# EAGLE design try (EAGLE 9.2.2)
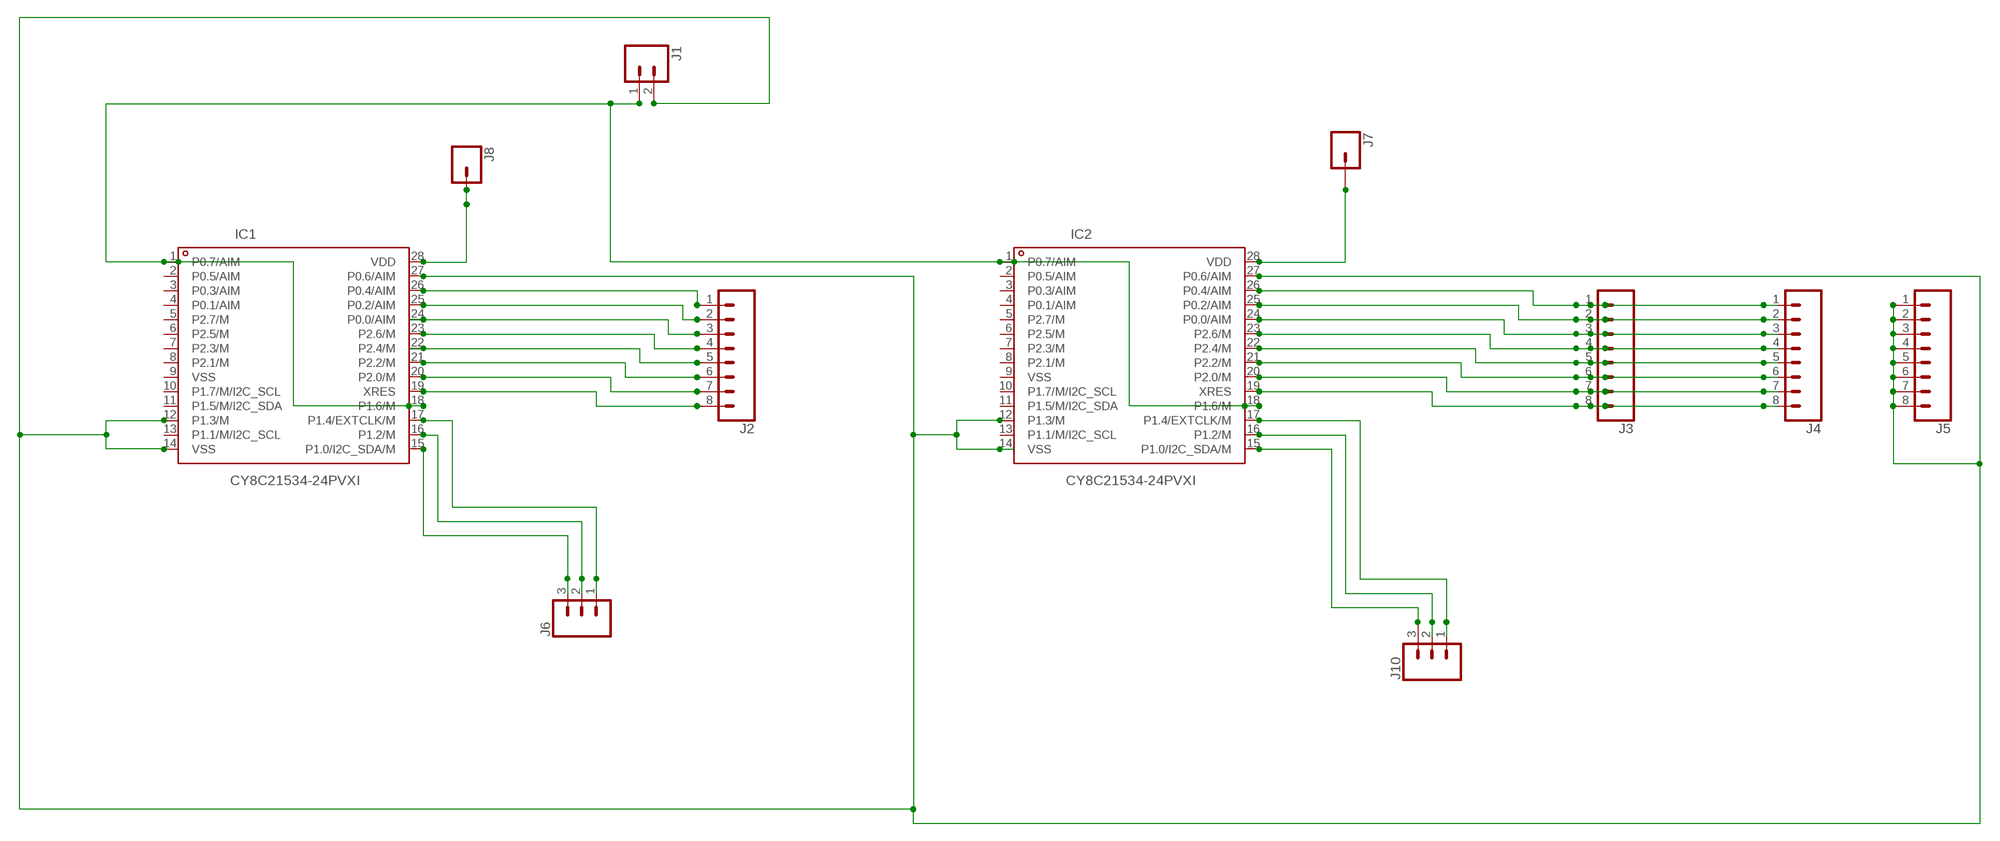
[diagram p0: schematic, sheet 1]

## Parts
IC1  CY8C21534-24PVXI  [SSOP28]
IC2  CY8C21534-24PVXI  [SSOP28]
J1  CONN_02PTH3  [1X02_LONGPADS]
J2  CONN_08LONGPADS  [1X08_LONGPADS]
J3  CONN_08LONGPADS  [1X08_LONGPADS]
J4  CONN_08LONGPADS  [1X08_LONGPADS]
J5  CONN_08LONGPADS  [1X08_LONGPADS]
J6  CONN_03LONGPADS  [1X03_LONGPADS]
J7  CONN_01PTH_LONGPAD  [1X01_LONGPAD]
J8  CONN_01PTH_LONGPAD  [1X01_LONGPAD]
J10  CONN_03LONGPADS  [1X03_LONGPADS]

## Nets
N$1: IC1.17(P1.4/EXTCLK/M) J6.1
N$2: IC2.15(P1.0/I2C_SDA/M) J10.3
N$3: IC1.12(P1.3/M) IC1.14(VSS) IC1.27(P0.6/AIM) IC2.12(P1.3/M) IC2.14(VSS) IC2.27(P0.6/AIM) J1.2 J5.1 J5.2 J5.3 J5.4 J5.5 J5.6 J5.7 J5.8
N$4: IC1.26(P0.4/AIM) J2.1
N$5: IC1.25(P0.2/AIM) J2.2
N$6: IC1.24(P0.0/AIM) J2.3
N$7: IC1.23(P2.6/M) J2.4
N$8: IC1.22(P2.4/M) J2.5
N$9: IC1.21(P2.2/M) J2.6
N$10: IC1.20(P2.0/M) J2.7
N$11: IC1.19(XRES) J2.8
N$12: IC2.26(P0.4/AIM) J3.1 J4.1
N$13: IC2.25(P0.2/AIM) J3.2 J4.2
N$14: IC2.24(P0.0/AIM) J3.3 J4.3
N$15: IC2.23(P2.6/M) J3.4 J4.4
N$16: IC2.22(P2.4/M) J3.5 J4.5
N$17: IC2.21(P2.2/M) J3.6 J4.6
N$18: IC2.20(P2.0/M) J3.7 J4.7
N$19: IC2.19(XRES) J3.8 J4.8
N$20: IC1.1(P0.7/AIM) IC1.18(P1.6/M) IC2.1(P0.7/AIM) IC2.18(P1.6/M) J1.1
N$21: IC1.28(VDD) J8.1
N$22: IC2.28(VDD) J7.1
N$25: IC1.15(P1.0/I2C_SDA/M) J6.3
N$26: IC1.16(P1.2/M) J6.2
N$27: IC2.16(P1.2/M) J10.2
N$28: IC2.17(P1.4/EXTCLK/M) J10.1
Unconnected: IC1.2(P0.5/AIM) IC1.3(P0.3/AIM) IC1.4(P0.1/AIM) IC1.5(P2.7/M) IC1.6(P2.5/M) IC1.7(P2.3/M) IC1.8(P2.1/M) IC1.9(VSS) IC1.10(P1.7/M/I2C_SCL) IC1.11(P1.5/M/I2C_SDA) IC1.13(P1.1/M/I2C_SCL) IC2.2(P0.5/AIM) IC2.3(P0.3/AIM) IC2.4(P0.1/AIM) IC2.5(P2.7/M) IC2.6(P2.5/M) IC2.7(P2.3/M) IC2.8(P2.1/M) IC2.9(VSS) IC2.10(P1.7/M/I2C_SCL) IC2.11(P1.5/M/I2C_SDA) IC2.13(P1.1/M/I2C_SCL)

## Library data of the parts
IC1 IC2 = cypressmicro:CY8C21534
J1 = SparkFun-Connectors:CONN_02: Multi connection point. Often used as Generic Header-pin footprint for 0.1 inch spaced/style header connections On any of the 0.1 inch spaced packages, you can populate with these: Break Away Headers - Straight <https://www.sparkfun.com/products/116> (PRT-00116) Break Away Male Headers - Right Angle <https://www.sparkfun.com/products/553> (PRT-00553) Female Headers <https://www.sparkfun.com/products/115> (PRT-00115) Break Away Headers - Machine Pin <https://www.sparkfun.com/products/117> (PRT-00117) Break Away Female Headers - Swiss Machine Pin <https://www.sparkfun.com/products/743> (PRT-00743) For SCREWTERMINALS and SPRING TERMINALS visit here: Screw Terimnals on SparkFun.com <https://www.sparkfun.com/search/results?term=Screw+Terminals> (5mm/3.5mm/2.54mm spacing) This device is also useful as a general connection point to wire up your design to another part of your project. Our various solder wires solder well into these plated through hole pads. Hook-Up Wire - Assortment (Stranded, 22 AWG) <https://www.sparkfun.com/products/11375> (PRT-11375) Hook-Up Wire - Assortment (Solid Core, 22 AWG) <https://www.sparkfun.com/products/11367> (PRT-11367) View the entire wire category on our website here <https://www.sparkfun.com/categories/141> Special notes: Molex polarized connector foot print use with: PRT-08233 with associated crimp pins and housings. 2.54_SCREWTERM for use with PRT-10571. 3.5mm Screw Terminal footprints for PRT-08084 5mm Screw Terminal footprints for use with PRT-08432
J2-J5 = SparkFun-Connectors:CONN_08: Multi connection point. Often used as Generic Header-pin footprint for 0.1 inch spaced/style header connections On any of the 0.1 inch spaced packages, you can populate with these: Break Away Headers - Straight <https://www.sparkfun.com/products/116> (PRT-00116) Break Away Male Headers - Right Angle <https://www.sparkfun.com/products/553> (PRT-00553) Female Headers <https://www.sparkfun.com/products/115> (PRT-00115) Break Away Headers - Machine Pin <https://www.sparkfun.com/products/117> (PRT-00117) Break Away Female Headers - Swiss Machine Pin <https://www.sparkfun.com/products/743> (PRT-00743) Arduino Stackable Header - 8 Pin <https://www.sparkfun.com/products/9279> (PRT-09279) For SCREWTERMINALS and SPRING TERMINALS visit here: Screw Terimnals on SparkFun.com <https://www.sparkfun.com/search/results?term=Screw+Terminals> (5mm/3.5mm/2.54mm spacing) This device is also useful as a general connection point to wire up your design to another part of your project. Our various solder wires solder well into these plated through hole pads. Hook-Up Wire - Assortment (Stranded, 22 AWG) <https://www.sparkfun.com/products/11375> (PRT-11375) Hook-Up Wire - Assortment (Solid Core, 22 AWG) <https://www.sparkfun.com/products/11367> (PRT-11367) View the entire wire category on our website here <https://www.sparkfun.com/categories/141> Special notes: Molex polarized connector foot print use with SKU : PRT-08231 with associated crimp pins and housings. 1MM SMD Version SKU: PRT-10208 NOTES ON THE VARIANTS LOCK and LOCK_LONGPADS... This footprint was designed to help hold the alignment of a through-hole component (i.e. 6-pin header) while soldering it into place. You may notice that each hole has been shifted either up or down by 0.005 of an inch from it's more standard position (which is a perfectly straight line). This slight alteration caused the pins (the squares in the middle) to touch the edges of the holes. Because they are alternating, it causes a "brace" to hold the component in place. 0.005 has proven to be the perfect amount of "off-center" position when using our standard breakaway headers. Although looks a little odd when you look at the bare footprint, once you have a header in there, the alteration is very hard to notice. Also,if you push a header all the way into place, it is covered up entirely on the bottom side.
J6 J10 = SparkFun-Connectors:CONN_03: Multi connection point. Often used as Generic Header-pin footprint for 0.1 inch spaced/style header connections On any of the 0.1 inch spaced packages, you can populate with these: Break Away Headers - Straight <https://www.sparkfun.com/products/116> (PRT-00116) Break Away Male Headers - Right Angle <https://www.sparkfun.com/products/553> (PRT-00553) Female Headers <https://www.sparkfun.com/products/115> (PRT-00115) Break Away Headers - Machine Pin <https://www.sparkfun.com/products/117> (PRT-00117) Break Away Female Headers - Swiss Machine Pin <https://www.sparkfun.com/products/743> (PRT-00743) Stackable Header - 3 Pin (Female, 0.1") <https://www.sparkfun.com/products/13875> (PRT-13875) For SCREWTERMINALS and SPRING TERMINALS visit here: Screw Terimnals on SparkFun.com <https://www.sparkfun.com/search/results?term=Screw+Terminals> (5mm/3.5mm/2.54mm spacing) This device is also useful as a general connection point to wire up your design to another part of your project. Our various solder wires solder well into these plated through hole pads. Hook-Up Wire - Assortment (Stranded, 22 AWG) <https://www.sparkfun.com/products/11375> (PRT-11375) Hook-Up Wire - Assortment (Solid Core, 22 AWG) <https://www.sparkfun.com/products/11367> (PRT-11367) View the entire wire category on our website here <https://www.sparkfun.com/categories/141> Special notes: Molex polarized connector foot print use with SKU : PRT-08232 with associated crimp pins and housings.
J7 J8 = SparkFun-Connectors:CONN_01: Single connection point. Often used as Generic Header-pin footprint for 0.1 inch spaced/style header connections On any of the 0.1 inch spaced packages, you can populate with these: Break Away Headers - Straight <https://www.sparkfun.com/products/116> (PRT-00116) Break Away Male Headers - Right Angle <https://www.sparkfun.com/products/553> (PRT-00553) Female Headers <https://www.sparkfun.com/products/115> (PRT-00115) Break Away Headers - Machine Pin <https://www.sparkfun.com/products/117> (PRT-00117) Break Away Female Headers - Swiss Machine Pin <https://www.sparkfun.com/products/743> (PRT-00743) This device is also useful as a general connection point to wire up your design to another part of your project. Our various solder wires solder well into these plated through hole pads. Hook-Up Wire - Assortment (Stranded, 22 AWG) <https://www.sparkfun.com/products/11375> (PRT-11375) Hook-Up Wire - Assortment (Solid Core, 22 AWG) <https://www.sparkfun.com/products/11367> (PRT-11367) View the entire wire category on our website here <https://www.sparkfun.com/categories/141> Special notes: SMTSO-256-ET is a "flush mount" nut for a 4-40 screw. We mostly use this on specialty testbeds; it is a nice way to connect hardware to your PCB at an adjustable hieght. Also note, the SNAP packages are for using a snappable style connector. We sell a baggie of snaps and they are also used on two LilyPad designs: Snap Assortment - 30 pack (male and female) <https://www.sparkfun.com/products/11347> (DEV-11347) LilyPad Arduino SimpleSnap <https://www.sparkfun.com/products/10941> (DEV-10941) LilyPad SimpleSnap Protoboard <https://www.sparkfun.com/products/10940> (DEV-10940)

## Board
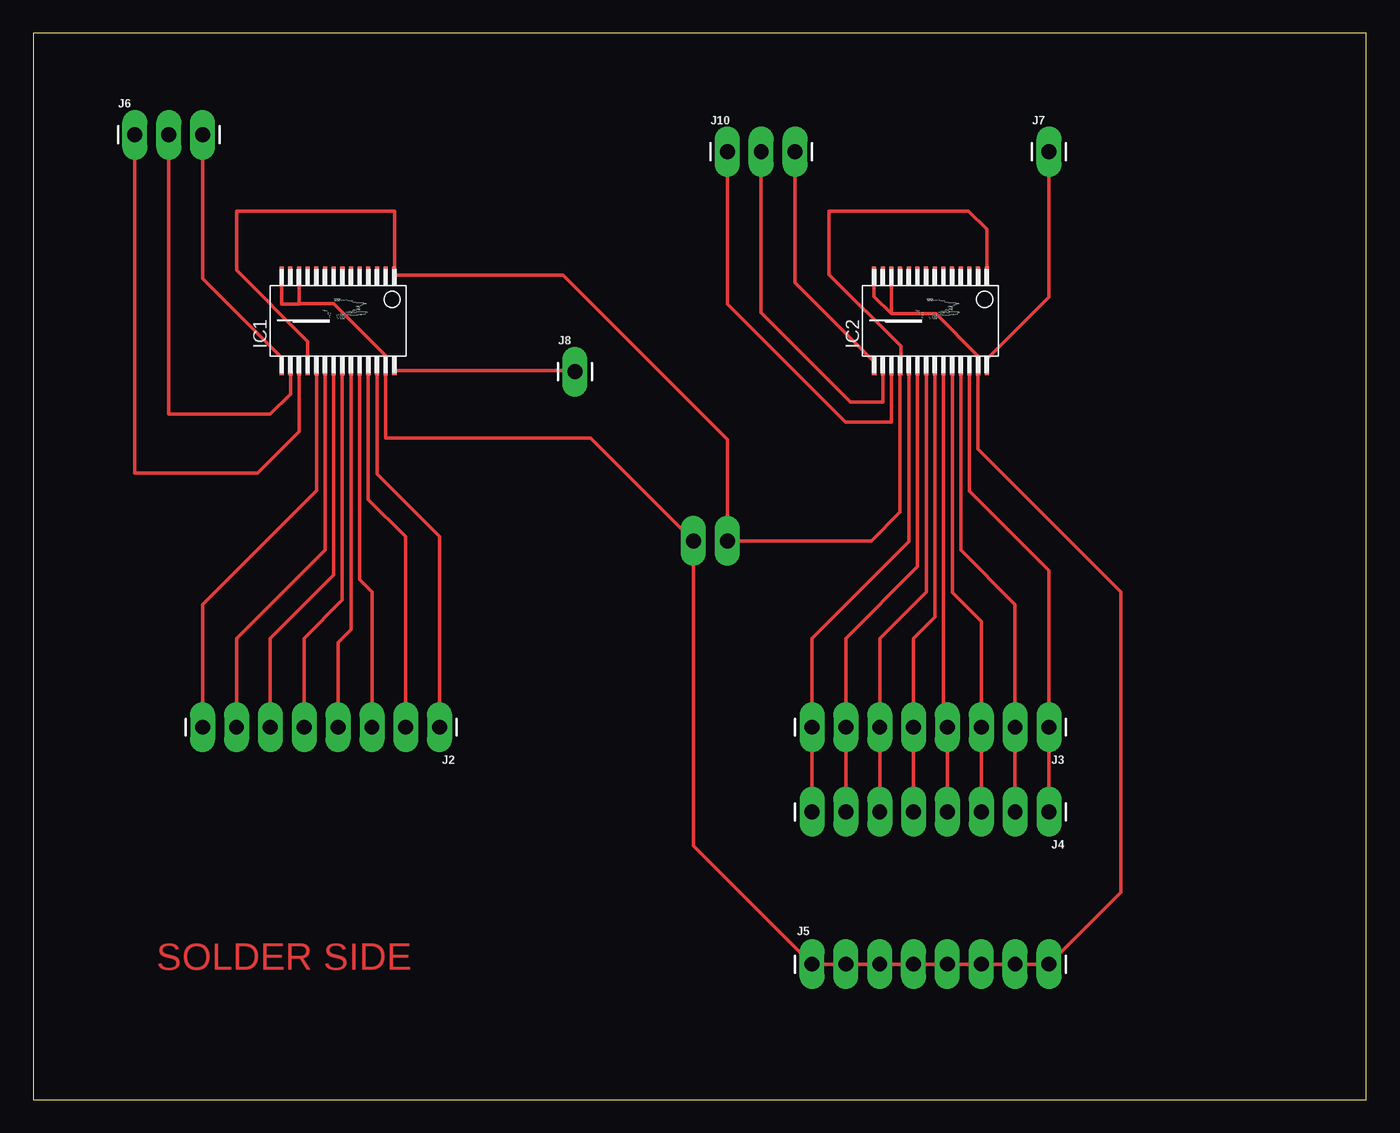
[diagram p1: board, top side]

Size 100 x 80 mm. Coordinates in mm from the lower left corner, seen from the top.
Outline: 0,0 100,0 100,80 0,80 0,0
Copper layers (1*16): Top 0.035mm / dielectric 1.5mm / Bottom 0.035mm
Design rules "default *": minimum track width 10mil, minimum drill 0.35mm, track to track 10mil, track to pad 10mil, pad to pad 6mil, via to via 6mil, smd to smd 6mil, copper to edge 40mil, drill to drill 6mil, minimum pad ring 10mil, minimum via ring 8mil, stop-mask expansion 4mil, vias tented up to drill 0mil, thermal gap 10mil

### Footprints (pad centres in the part's own frame; a part is rotated, then mirrored left to right if it is on the bottom)
SSOP28 = smd 0.305 x 1.245: 1 4.224,3.441; 2 3.574,3.441; 3 2.924,3.441; 4 2.274,3.441; 5 1.624,3.441; 6 0.974,3.441; 7 0.325,3.44; 8 -0.326,3.441; 9 -0.976,3.441; 10 -1.626,3.441; 11 -2.276,3.441; 12 -2.926,3.441; 13 -3.576,3.441; 14 -4.226,3.441; 15 -4.224,-3.441; 16 -3.574,-3.441; 17 -2.924,-3.441; 18 -2.274,-3.441; 19 -1.624,-3.441; 20 -0.974,-3.441; 21 -0.324,-3.441; 22 0.326,-3.441; 23 0.976,-3.441; 24 1.626,-3.441; 25 2.276,-3.441; 26 2.926,-3.441; 27 3.576,-3.441; 28 4.226,-3.441
1X02_LONGPADS = drill 1.118 pad 1.88 long: 1 0,0; 2 2.54,0
1X08_LONGPADS = drill 1.118 pad 1.88 long: 1 0,0; 2 2.54,0; 3 5.08,0; 4 7.62,0; 5 10.16,0; 6 12.7,0; 7 15.24,0; 8 17.78,0
1X03_LONGPADS = drill 1.118 pad 1.88 long: 1 0,0; 2 2.54,0; 3 5.08,0
1X01_LONGPAD = drill 1.118 pad 1.88 long: 1 0,0

### Placement (x,y rotation side)
IC1  22.86,58.42 0 top
IC2  67.31,58.42 0 top
J1  52.07,41.91 0 bottom
J2  30.48,27.94 180 top
J3  76.2,27.94 180 top
J4  76.2,21.59 180 top
J5  58.42,10.16 0 top
J6  7.62,72.39 0 top
J7  76.2,71.12 0 top
J8  40.64,54.61 0 top
J10  52.07,71.12 0 top

### Tracks (layer width: path | path; a pad name or v marks a point on that pad's centre or on a via)
N$1
  Top 0.254: J6.1 7.62,46.99 16.83,46.99 19.95,50.11 19.95,54.42 19.94,54.4 IC1.17
N$2
  Top 0.254: J10.3 57.15,61.28 63.09,55.33 63.09,55.31 IC2.15
N$3
  Top 0.254: IC1.14 18.63,59.69 19.93,59.69 IC1.12 | 19.93,60.02 19.93,59.7 22.53,59.7 26.43,55.8 26.43,55 IC1.27 26.43,54.98 26.43,49.63 41.81,49.63 J1.2 49.53,41.99 49.54,42 49.54,19.04 J5.1 J5.2 J5.3 J5.4 J5.5 J5.6 J5.7 J5.8 81.6,15.56 81.6,38.1 70.88,48.82 IC2.27 70.89,55.8 67.73,58.95 64.38,58.95 | IC2.14 63.08,60.25 64.38,58.95 | IC2.12 64.38,58.95
N$4
  Top 0.254: J2.1 30.48,42.23 25.79,46.91 IC1.26
N$5
  Top 0.254: J2.2 27.94,42.23 25.13,45.03 25.13,54.77 25.14,54.77 IC1.25
N$6
  Top 0.254: J2.3 25.4,38.1 24.5,39 24.5,55.18 24.49,55.16 IC1.24
N$7
  Top 0.254: J2.4 22.86,34.29 23.84,35.27 23.84,54.8 IC1.23
N$8
  Top 0.254: J2.5 20.32,34.61 23.18,37.47 23.18,54.93 IC1.22
N$9
  Top 0.254: J2.6 17.78,34.61 22.54,39.37 22.54,54.93 IC1.21
N$10
  Top 0.254: J2.7 15.24,34.61 21.88,41.25 21.88,54.77 21.89,54.78 IC1.20
N$11
  Top 0.254: J2.8 12.7,37.15 21.25,45.7 IC1.19
N$12
  Top 0.254: IC2.26 70.24,45.64 76.2,39.69 J3.1 J4.1
N$13
  Top 0.254: IC2.25 69.59,54.8 69.58,54.8 69.58,41.22 73.66,37.15 J3.2 J4.2
N$14
  Top 0.254: IC2.24 68.94,54.71 68.95,54.7 68.95,38.05 71.12,35.88 J3.3 J4.3
N$15
  Top 0.254: IC2.23 68.29,54.78 68.29,54.77 68.29,28.23 J3.4 J4.4
N$16
  Top 0.254: IC2.22 67.63,54.93 67.63,36.2 66.04,34.61 J3.5 J4.5
N$17
  Top 0.254: IC2.21 66.99,54.93 66.99,38.1 63.5,34.61 J3.6 J4.6
N$18
  Top 0.254: IC2.20 66.34,54.75 66.33,54.75 66.33,39.98 60.96,34.61 J3.7 J4.7
N$19
  Top 0.254: IC2.19 65.69,54.66 65.7,54.65 65.7,41.88 58.42,34.61 J3.8 J4.8
N$20
  Top 0.254: IC1.18 20.59,55.52 20.59,56.88 15.24,62.23 15.24,66.67 27.09,66.67 27.09,61.92 27.08,61.91 IC1.1 | IC2.1 71.54,65.3 70.17,66.67 59.69,66.67 59.69,61.91 65.09,56.52 65.09,55.24 IC2.18 65.04,54.62 65.04,44.08 62.87,41.91 J1.1 52.07,49.53 39.74,61.86 IC1.1 | IC1.1 27.08,61.89 27.06,61.9
N$21
  Top 0.254: J8.1 40.64,54.7 27.09,54.7 IC1.28
N$22
  Top 0.254: J7.1 76.2,60.21 71.54,55.55 IC2.28
N$25
  Top 0.254: J6.3 12.7,61.58 18.63,55.65 18.64,55.65 IC1.15
N$26
  Top 0.254: J6.2 10.16,51.44 17.78,51.44 19.29,52.95 19.29,54.75 19.29,54.74 IC1.16
N$27
  Top 0.254: 63.77,54.96 IC2.16 63.73,54.97 63.73,52.35 61.32,52.35 54.61,59.05 J10.2
N$28
  Top 0.254: 64.43,54.79 64.39,54.8 IC2.17 64.38,54.97 64.38,50.84 60.92,50.84 52.07,59.69 J10.1

### Text on the board
Top: SOLDER SIDE